# EAGLE design smd_circuit (EAGLE 5.11)
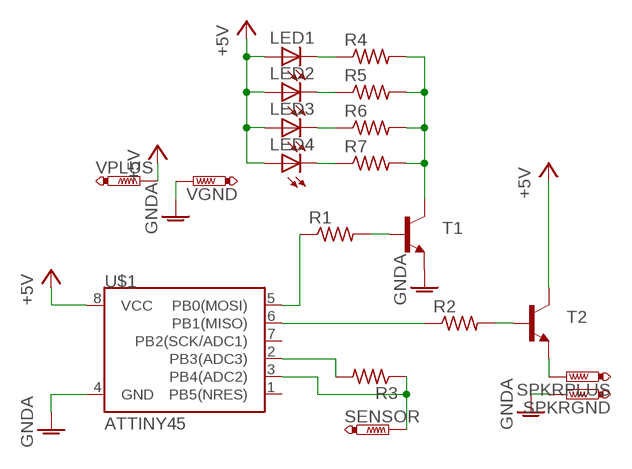
[diagram p0: schematic, sheet 1]

## Parts
LED1  LEDOPTEK-DURIS5  [OPTEK-DURIS5]
LED2  LEDOPTEK-DURIS5  [OPTEK-DURIS5]
LED3  LEDOPTEK-DURIS5  [OPTEK-DURIS5]
LED4  LEDOPTEK-DURIS5  [OPTEK-DURIS5]
R1  R-US_R0603  [R0603]
R2  R-US_R0603  [R0603]
R3  R-US_R0603  [R0603]
R4  R-US_R1210  [R1210]
R5  R-US_R1210  [R1210]
R6  R-US_R1210  [R1210]
R7  R-US_R1210  [R1210]
SENSOR  PTR1PAD1-13  [P1-13]
SPKRGND  PTR1PAD1-13  [P1-13]
SPKRPLUS  PTR1PAD1-13  [P1-13]
T1  SOT23-BEC  [SOT23-BEC]
T2  SOT23-BEC  [SOT23-BEC]
U$1  ATTINY45  [SO08-EIAJ]
VGND  PTR1PAD1-13  [P1-13]
VPLUS  PTR1PAD1-13  [P1-13]

## Nets
+5V: LED1.ANODE(A) LED2.ANODE(A) LED3.ANODE(A) LED4.ANODE(A) T2.C U$1.8(VCC) VPLUS.TP
GNDA: SPKRGND.TP T1.E U$1.4(GND) VGND.TP
N$1: R3.2 U$1.2(PB3(ADC3))
N$3: R2.1 U$1.6(PB1(MISO))
N$4: R2.2 T2.B
N$5: R4.2 R5.2 R6.2 R7.2 T1.C
N$6: R1.2 T1.B
N$7: R1.1 U$1.5(PB0(MOSI))
N$8: SPKRPLUS.TP T2.E
N$9: LED1.CATHODE(C) R4.1
N$10: LED2.CATHODE(C) R5.1
N$11: LED3.CATHODE(C) R6.1
N$12: LED4.CATHODE(C) R7.1
N$19: R3.1 SENSOR.TP U$1.3(PB4(ADC2))
Unconnected: U$1.1(PB5(NRES)) U$1.7(PB2(SCK/ADC1))

## Library data of the parts
LED1-LED4 = smd_parts:LED: LED OSRAM: - CHIPLED LG R971, LG N971, LY N971, LG Q971, LY Q971, LO R971, LY R971 LH N974, LH R974 LS Q976, LO Q976, LY Q976 LO Q996 - Hyper CHIPLED LW Q18S LB Q993, LB Q99A, LB R99A - SideLED LS A670, LO A670, LY A670, LG A670, LP A670 LB A673, LV A673, LT A673, LW A673 LH A674 LY A675 LS A676, LA A676, LO A676, LY A676, LW A676 LS A679, LY A679, LG A679 - Hyper Micro SIDELED® LS Y876, LA Y876, LO Y876, LY Y876 LT Y87S - SmartLED LW L88C, LW L88S LB L89C, LB L89S, LG L890 LS L89K, LO L89K, LY L89K LS L896, LA L896, LO L896, LY L896 - TOPLED LS T670, LO T670, LY T670, LG T670, LP T670 LSG T670, LSP T670, LSY T670, LOP T670, LYG T670 LG T671, LOG T671, LSG T671 LB T673, LV T673, LT T673, LW T673 LH T674 LS T676, LA T676, LO T676, LY T676, LB T676, LH T676, LSB T676, LW T676 LB T67C, LV T67C, LT T67C, LS T67K, LO T67K, LY T67K, LW E67C LS E67B, LA E67B, LO E67B, LY E67B, LB E67C, LV E67C, LT E67C LW T67C LS T679, LY T679, LG T679 LS T770, LO T770, LY T770, LG T770, LP T770 LB T773, LV T773, LT T773, LW T773 LH T774 LS E675, LA E675, LY E675, LS T675 LS T776, LA T776, LO T776, LY T776, LB T776 LHGB T686 LT T68C, LB T68C - Hyper Mini TOPLED® LB M676 - Mini TOPLED Santana® LG M470 LS M47K, LO M47K, LY M47K Source: http://www.osram.convergy.de LUXEON: - LUMILED® LXK2-PW12-R00, LXK2-PW12-S00, LXK2-PW14-U00, LXK2-PW14-V00 LXK2-PM12-R00, LXK2-PM12-S00, LXK2-PM14-U00 LXK2-PE12-Q00, LXK2-PE12-R00, LXK2-PE12-S00, LXK2-PE14-T00, LXK2-PE14-U00 LXK2-PB12-K00, LXK2-PB12-L00, LXK2-PB12-M00, LXK2-PB14-N00, LXK2-PB14-P00, LXK2-PB14-Q00 LXK2-PR12-L00, LXK2-PR12-M00, LXK2-PR14-Q00, LXK2-PR14-R00 LXK2-PD12-Q00, LXK2-PD12-R00, LXK2-PD12-S00 LXK2-PH12-R00, LXK2-PH12-S00 LXK2-PL12-P00, LXK2-PL12-Q00, LXK2-PL12-R00 Source: www.luxeon.com KINGBRIGHT: KA-3528ASYC Source: www.kingbright.com
R1-R7 = rcl:R-US_: RESISTOR, American symbol
SENSOR SPKRGND SPKRPLUS VGND VPLUS = testpad:PTR1: TEST PIN
T1 T2 = smd_parts:SOT23-BEC
U$1 = SparkFun:ATTINY45: Atmel ATTiny45

## Board
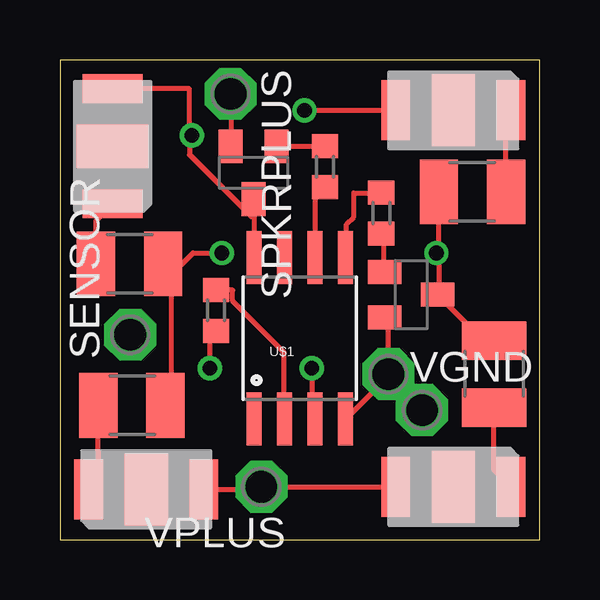
[diagram p1: board, top side]
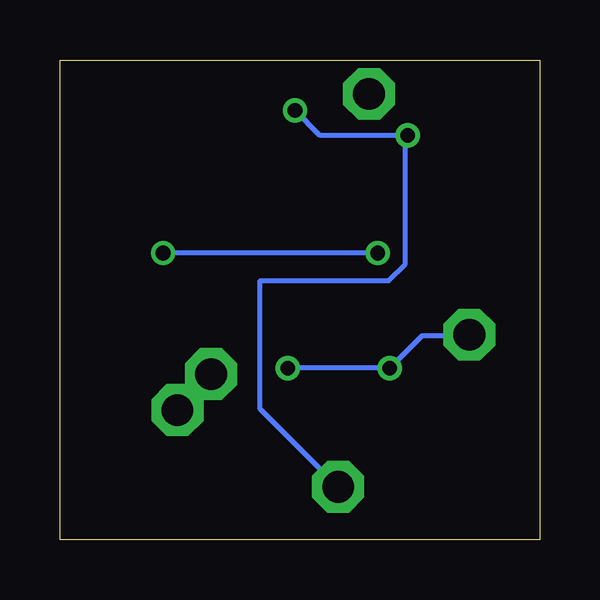
[diagram p2: board, bottom side, seen from below]

Size 20 x 20 mm. Coordinates in mm from the lower left corner, seen from the top.
Outline: 0,0 20,0 20,20 0,20 0,0
Copper layers (1*16): Top 0.035mm / dielectric 1.5mm / Bottom 0.035mm
Design rules "default *": minimum track width 8mil, minimum drill 24mil, track to track 20mil, track to pad 20mil, pad to pad 20mil, via to via 20mil, smd to smd 20mil, copper to edge 7mil, drill to drill 8mil, minimum pad ring 10mil, minimum via ring 8mil, stop-mask expansion 4mil, vias tented up to drill 0mil, thermal gap 10mil

### Footprints (pad centres in the part's own frame; a part is rotated, then mirrored left to right if it is on the bottom)
OPTEK-DURIS5 = smd 2.5 x 1.2: ANODE 0,-2.4; CATHODE 0,2.4 | smd 3 x 1.8: P$5 0,0
R0603 = smd 1 x 1.1: 1 -0.85,0; 2 0.85,0
R1210 = smd 1.6 x 2.7: 1 -1.4,0; 2 1.4,0
P1-13 = drill 1.321 pad 2.159 octagon: TP 0,0
SOT23-BEC = smd 1 x 1.4: B -0.95,-1.1; C 0,1.1; E 0.95,-1.1
SO08-EIAJ = smd 0.61 x 2.21: 1 -1.905,-3.378; 2 -0.635,-3.378; 3 0.635,-3.378; 4 1.905,-3.378; 5 1.905,3.353; 6 0.635,3.353; 7 -0.635,3.353; 8 -1.905,3.353

### Placement (x,y rotation side)
LED1  16.4,17.9 270 top
LED2  16.4,2.2 270 top
LED3  3.6,2.1 90 top
LED4  2.2,16.4 180 top
R1  13.4,13.61 270 top
R2  11.05,15.55 90 top
R3  6.51,9.56 90 top
R4  17.2,14.5 180 top
R5  18.1,6.9 90 top
R6  3,5.6 0 top
R7  2.9,11.5 0 top
SENSOR  2.93,8.54 90 top
SPKRGND  15.1,5.4 0 top
SPKRPLUS  7.11,18.59 270 top
T1  14.64,10.21 270 top
T2  8.07,15.3 180 top
U$1  10,8.4 0 top
VGND  13.7,6.9 0 top
VPLUS  8.4,2.2 180 top

### Tracks (layer width: path | path; a pad name or v marks a point on that pad's centre or on a via)
+5V  (via drill 0.61)
  Top 0.203: LED3.ANODE 8.4,2.1 VPLUS.TP LED2.ANODE | 8.1,13.45 8.1,11.8 U$1.8 | 8.1,13.45 8.1,14.15 T2.C | LED4.ANODE 5.4,18.8 5.4,16.85 | 5.4,16.85 5.4,16.05 8,13.45 8.1,13.45 | v10.2,17.9 LED1.ANODE | v5.5,16.85 5.4,16.85
  Bottom 0.203: v10.2,17.9 9.15,16.85 v5.5,16.85 5.6,16.75 5.6,11.5 6.3,10.8 11.65,10.8 11.65,5.45 VPLUS.TP
GNDA
  Top 0.203: VGND.TP 13.7,9.1 T1.E | U$1.4 11.95,5.05 13.7,6.8 VGND.TP | SPKRGND.TP 13.75,6.75 VGND.TP
N$1
  Top 0.203: R3.2 6.55,10.4 7.2,10.4 7.2,9.95 9.35,7.8 9.35,5.05 U$1.2
N$3
  Top 0.203: R2.1 11.05,14.65 10.65,14.25 10.65,11.8 U$1.6
N$4
  Top 0.203: R2.2 9.05,16.4 T2.B
N$5  (via drill 0.61)
  Top 0.203: R6.2 4.65,5.85 4.65,11.15 R7.2 4.75,11.15 5.55,11.95 v6.75,11.95 | R5.2 17.65,8.3 T1.C 15.8,10.3 15.8,11.95 | 15.8,11.95 R4.2 | v15.7,11.95 15.8,11.95
  Bottom 0.203: v6.75,11.95 v15.7,11.95
N$6
  Top 0.203: R1.2 13.5,12.65 13.5,11.2 T1.B
N$7
  Top 0.203: R1.1 13.35,14.45 12.25,14.45 12.25,13.45 11.95,13.15 11.95,11.8 U$1.5
N$8
  Top 0.203: T2.E 7.15,16.4 7.15,18.55 SPKRPLUS.TP
N$9
  Top 0.203: LED1.CATHODE 18.6,17.7 R4.1
N$10
  Top 0.203: LED2.CATHODE 18.1,2.9 R5.1
N$11
  Top 0.203: LED3.CATHODE 1.6,2.5 R6.1
N$12
  Top 0.203: LED4.CATHODE 1.5,13.3 R7.1
N$19  (via drill 0.61)
  Top 0.203: v6.25,7.15 6.25,8.45 R3.1 | v10.5,7.15 10.5,5.15 10.6,5.05 U$1.3
  Bottom 0.203: SENSOR.TP 2.95,8.5 4.9,8.5 v6.25,7.15 v10.5,7.15